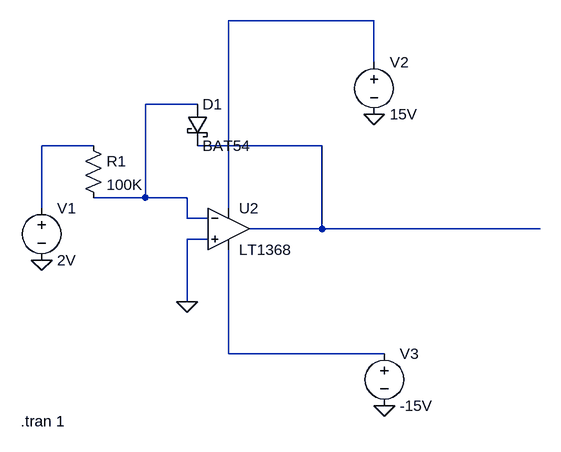
[diagram p0: schematic Draft3.asc]
Draft3.asc, the LTspice schematic file:
Version 4
SHEET 1 936 680
WIRE 560 -144 336 -144
WIRE 560 -80 560 -144
WIRE 288 -16 208 -16
WIRE 128 48 48 48
WIRE 480 48 288 48
WIRE 208 128 208 -16
WIRE 208 128 128 128
WIRE 272 128 208 128
WIRE 48 144 48 48
WIRE 336 144 336 -144
WIRE 272 160 272 128
WIRE 304 160 272 160
WIRE 480 176 480 48
WIRE 480 176 368 176
WIRE 816 176 480 176
WIRE 304 192 272 192
WIRE 272 288 272 192
WIRE 336 368 336 208
WIRE 576 368 336 368
FLAG 48 224 0
FLAG 576 448 0
FLAG 560 0 0
FLAG 272 288 0
SYMBOL voltage 48 128 R0
WINDOW 123 0 0 Left 0
WINDOW 39 0 0 Left 0
SYMATTR InstName V1
SYMATTR Value 2V
SYMBOL res 112 32 R0
SYMATTR InstName R1
SYMATTR Value 100K
SYMBOL voltage 560 -96 R0
WINDOW 123 0 0 Left 0
WINDOW 39 0 0 Left 0
SYMATTR InstName V2
SYMATTR Value 15V
SYMBOL voltage 576 352 R0
WINDOW 123 0 0 Left 0
WINDOW 39 0 0 Left 0
SYMATTR InstName V3
SYMATTR Value -15V
SYMBOL OpAmps\\LT1368 336 112 R0
SYMATTR InstName U2
SYMBOL schottky 272 -16 R0
SYMATTR InstName D1
SYMATTR Value BAT54
SYMATTR Description Diode
SYMATTR Type diode
TEXT 16 472 Left 2 !.tran 1

The netlist it stands for:
* Draft3.asc
V1 N003 0 2V
R1 N003 N002 100K
V2 N001 0 15V
V3 N005 0 -15V
XU2 0 N002 N001 N005 N004 LT1368  ; pins In+ In- V+ V- OUT
D1 N002 N004 BAT54
.model D D
.lib standard.dio
.tran 1
.backanno
.end